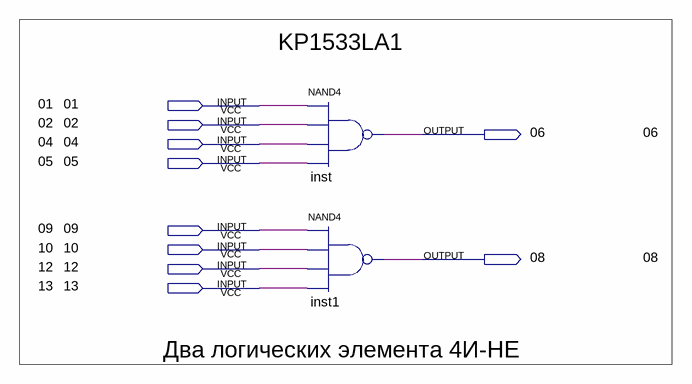
[diagram p0: schematic sheet]
// Quartus schematic KP1533LA1.bdf as structural Verilog: 2 symbols, 10 pins
module KP1533LA1 (
  input  \01 ,
  input  \02 ,
  input  \04 ,
  input  \05 ,
  input  \09 ,
  input  \10 ,
  input  \12 ,
  input  \13 ,
  output \06 ,
  output \08 
);

  nand inst (\06 , \01 , \02 , \04 , \05 );
  nand inst1 (\08 , \09 , \10 , \12 , \13 );

  // Notes on the sheet:
  //   KP1533LA1
  //   01
  //   02
  //   06
  //   04
  //   05
  //   09
  //   10
  //   08
  //   12
  //   13
  //   Два логических элемента 4И-НЕ
endmodule
